# Altium schematic sheet Buttons.SchDoc
size B
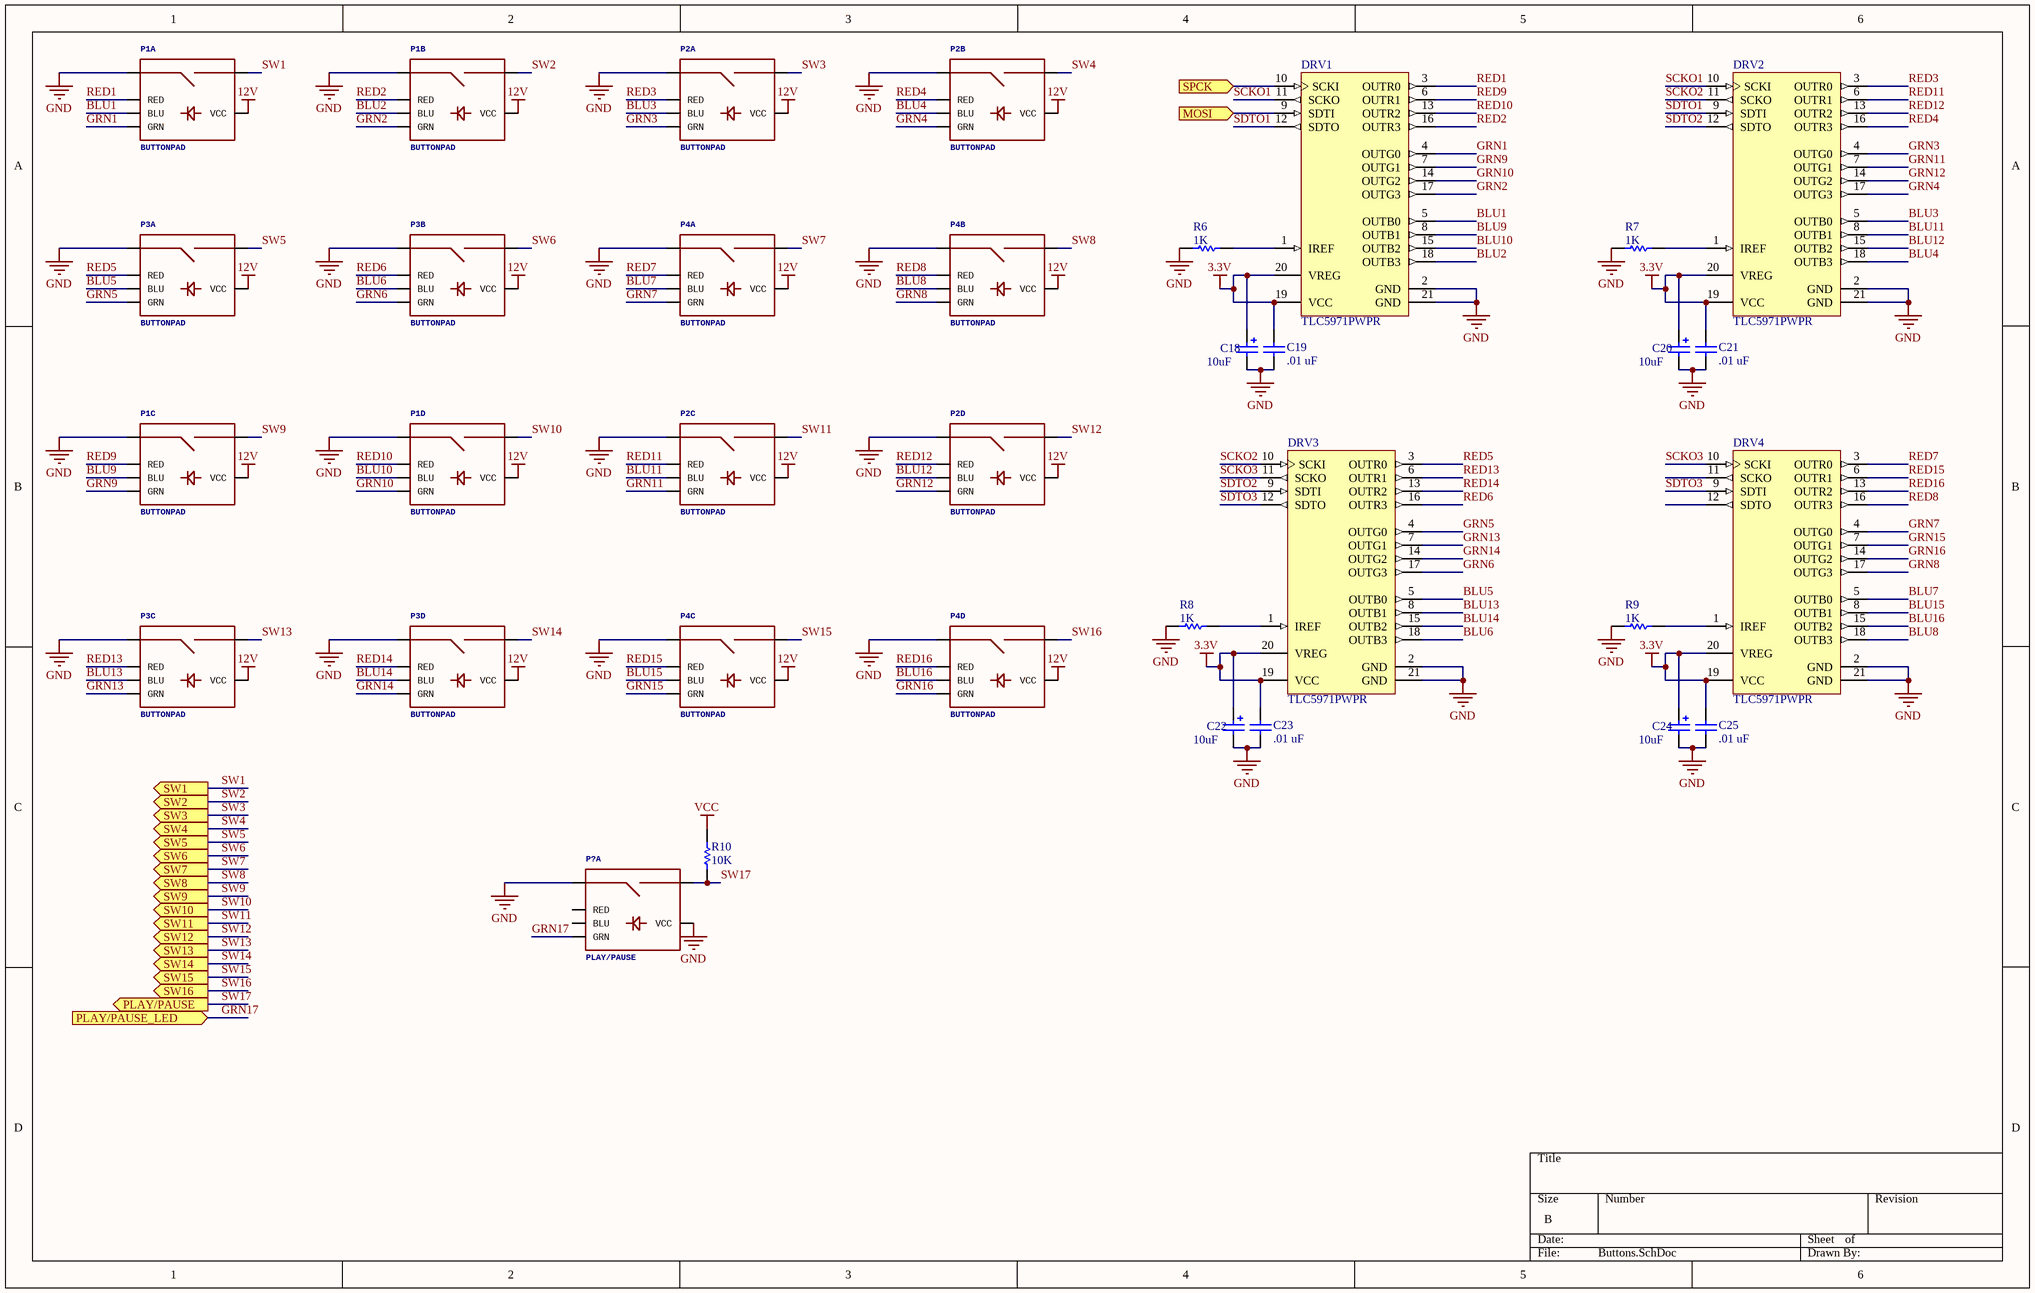
[diagram p0: Buttons.SchDoc]

## Parts
C18  value 10uF  [RAD-0.2]
C19  value .01 uF  [RAD-0.1]  (hidden comment: Cap)
C20  value 10uF  [RAD-0.2]
C21  value .01 uF  [RAD-0.1]  (hidden comment: Cap)
C22  value 10uF  [RAD-0.2]
C23  value .01 uF  [RAD-0.1]  (hidden comment: Cap)
C24  value 10uF  [RAD-0.2]
C25  value .01 uF  [RAD-0.1]  (hidden comment: Cap)
DRV1  TLC5971PWPR  [TI-PWP20-2965X2290TP_N]
DRV2  TLC5971PWPR  [TI-PWP20-2965X2290TP_N]
DRV3  TLC5971PWPR  [TI-PWP20-2965X2290TP_N]
DRV4  TLC5971PWPR  [TI-PWP20-2965X2290TP_N]
P1  BUTTONPAD  [BUTTONPAD-2X2]  (parts A,B,C,D of 4)
P2  BUTTONPAD  [BUTTONPAD-2X2]  (parts A,B,C,D of 4)
P3  BUTTONPAD  [BUTTONPAD-2X2]  (parts A,B,C,D of 4)
P4  BUTTONPAD  [BUTTONPAD-2X2]  (parts A,B,C,D of 4)
P?  PLAY/PAUSE  [BUTTONPAD-1X1]  (part A of 4)
R6  value 1K  [AXIAL-0.3]  (hidden comment: R1)
R7  value 1K  [AXIAL-0.3]  (hidden comment: R2)
R8  value 1K  [AXIAL-0.3]  (hidden comment: R3)
R9  value 1K  [AXIAL-0.3]  (hidden comment: R4)
R10  value 10K  [AXIAL-0.3]  (hidden comment: R3)

## Ports
MOSI (in), PLAY/PAUSE (out), PLAY/PAUSE_LED (in), SPCK (in), SW1 (out), SW2 (out), SW3 (out), SW4 (out), SW5 (out), SW6 (out), SW7 (out), SW8 (out), SW9 (out), SW10 (out), SW11 (out), SW12 (out), SW13 (out), SW14 (out), SW15 (out), SW16 (out)

## Nets
3.3V: C18.1 C19.2 C20.1 C21.2 C22.1 C23.2 C24.1 C25.2 DRV1.19(VCC) DRV1.20(VREG) DRV2.19(VCC) DRV2.20(VREG) DRV3.19(VCC) DRV3.20(VREG) DRV4.19(VCC) DRV4.20(VREG)
12V: P1.VCC1(VCC) P1.VCC2(VCC) P1.VCC3(VCC) P1.VCC4(VCC) P2.VCC1(VCC) P2.VCC2(VCC) P2.VCC3(VCC) P2.VCC4(VCC) P3.VCC1(VCC) P3.VCC2(VCC) P3.VCC3(VCC) P3.VCC4(VCC) P4.VCC1(VCC) P4.VCC2(VCC) P4.VCC3(VCC) P4.VCC4(VCC)
GND: C18.2 C19.1 C20.2 C21.1 C22.2 C23.1 C24.2 C25.1 DRV1.2(GND) DRV1.21(GND) DRV2.2(GND) DRV2.21(GND) DRV3.2(GND) DRV3.21(GND) DRV4.2(GND) DRV4.21(GND) P1.SIG1 P1.SIG3(SIG1) P1.SIG5(SIG1) P1.SIG7(SIG1) P2.SIG1 P2.SIG3(SIG1) P2.SIG5(SIG1) P2.SIG7(SIG1) P3.SIG1 P3.SIG3(SIG1) P3.SIG5(SIG1) P3.SIG7(SIG1) P4.SIG1 P4.SIG3(SIG1) P4.SIG5(SIG1) P4.SIG7(SIG1) P?.SIG1 P?.VCC1(VCC) R6.1 R7.1 R8.1 R9.1
VCC: R10.2
BLU1: DRV1.5(OUTB0) P1.BLU1(BLU)
BLU2: DRV1.18(OUTB3) P1.BLU2(BLU)
BLU3: DRV2.5(OUTB0) P2.BLU1(BLU)
BLU4: DRV2.18(OUTB3) P2.BLU2(BLU)
BLU5: DRV3.5(OUTB0) P3.BLU1(BLU)
BLU6: DRV3.18(OUTB3) P3.BLU2(BLU)
BLU7: DRV4.5(OUTB0) P4.BLU1(BLU)
BLU8: DRV4.18(OUTB3) P4.BLU2(BLU)
BLU9: DRV1.8(OUTB1) P1.BLU3(BLU)
BLU10: DRV1.15(OUTB2) P1.BLU4(BLU)
BLU11: DRV2.8(OUTB1) P2.BLU3(BLU)
BLU12: DRV2.15(OUTB2) P2.BLU4(BLU)
BLU13: DRV3.8(OUTB1) P3.BLU3(BLU)
BLU14: DRV3.15(OUTB2) P3.BLU4(BLU)
BLU15: DRV4.8(OUTB1) P4.BLU3(BLU)
BLU16: DRV4.15(OUTB2) P4.BLU4(BLU)
GRN1: DRV1.4(OUTG0) P1.GRN1(GRN)
GRN2: DRV1.17(OUTG3) P1.GRN2(GRN)
GRN3: DRV2.4(OUTG0) P2.GRN1(GRN)
GRN4: DRV2.17(OUTG3) P2.GRN2(GRN)
GRN5: DRV3.4(OUTG0) P3.GRN1(GRN)
GRN6: DRV3.17(OUTG3) P3.GRN2(GRN)
GRN7: DRV4.4(OUTG0) P4.GRN1(GRN)
GRN8: DRV4.17(OUTG3) P4.GRN2(GRN)
GRN9: DRV1.7(OUTG1) P1.GRN3(GRN)
GRN10: DRV1.14(OUTG2) P1.GRN4(GRN)
GRN11: DRV2.7(OUTG1) P2.GRN3(GRN)
GRN12: DRV2.14(OUTG2) P2.GRN4(GRN)
GRN13: DRV3.7(OUTG1) P3.GRN3(GRN)
GRN14: DRV3.14(OUTG2) P3.GRN4(GRN)
GRN15: DRV4.7(OUTG1) P4.GRN3(GRN)
GRN16: DRV4.14(OUTG2) P4.GRN4(GRN)
GRN17: P?.GRN1(GRN) ; port PLAY/PAUSE_LED
MOSI: DRV1.9(SDTI) ; port MOSI
RED1: DRV1.3(OUTR0) P1.RED1(RED)
RED2: DRV1.16(OUTR3) P1.RED2(RED)
RED3: DRV2.3(OUTR0) P2.RED1(RED)
RED4: DRV2.16(OUTR3) P2.RED2(RED)
RED5: DRV3.3(OUTR0) P3.RED1(RED)
RED6: DRV3.16(OUTR3) P3.RED2(RED)
RED7: DRV4.3(OUTR0) P4.RED1(RED)
RED8: DRV4.16(OUTR3) P4.RED2(RED)
RED9: DRV1.6(OUTR1) P1.RED3(RED)
RED10: DRV1.13(OUTR2) P1.RED4(RED)
RED11: DRV2.6(OUTR1) P2.RED3(RED)
RED12: DRV2.13(OUTR2) P2.RED4(RED)
RED13: DRV3.6(OUTR1) P3.RED3(RED)
RED14: DRV3.13(OUTR2) P3.RED4(RED)
RED15: DRV4.6(OUTR1) P4.RED3(RED)
RED16: DRV4.13(OUTR2) P4.RED4(RED)
SCKO1: DRV1.11(SCKO) DRV2.10(SCKI)
SCKO2: DRV2.11(SCKO) DRV3.10(SCKI)
SCKO3: DRV3.11(SCKO) DRV4.10(SCKI)
SDTO1: DRV1.12(SDTO) DRV2.9(SDTI)
SDTO2: DRV2.12(SDTO) DRV3.9(SDTI)
SDTO3: DRV3.12(SDTO) DRV4.9(SDTI)
SPCK: DRV1.10(SCKI) ; port SPCK
SW1: P1.SIG2 ; port SW1
SW2: P1.SIG4(SIG2) ; port SW2
SW3: P2.SIG2 ; port SW3
SW4: P2.SIG4(SIG2) ; port SW4
SW5: P3.SIG2 ; port SW5
SW6: P3.SIG4(SIG2) ; port SW6
SW7: P4.SIG2 ; port SW7
SW8: P4.SIG4(SIG2) ; port SW8
SW9: P1.SIG6(SIG2) ; port SW9
SW10: P1.SIG8(SIG2) ; port SW10
SW11: P2.SIG6(SIG2) ; port SW11
SW12: P2.SIG8(SIG2) ; port SW12
SW13: P3.SIG6(SIG2) ; port SW13
SW14: P3.SIG8(SIG2) ; port SW14
SW15: P4.SIG6(SIG2) ; port SW15
SW16: P4.SIG8(SIG2) ; port SW16
SW17: P?.SIG2 R10.1 ; port PLAY/PAUSE
NetDRV1_1: DRV1.1(IREF) R6.2
NetDRV2_1: DRV2.1(IREF) R7.2
NetDRV3_1: DRV3.1(IREF) R8.2
NetDRV4_1: DRV4.1(IREF) R9.2

Not connected (* = marked no-connect by the designer): DRV4 11(SCKO) 12(SDTO); P? BLU1(BLU) RED1(RED)

## Library data of the parts
C18 C20 C22 C24 = Cap Pol2: Polarized Capacitor (Axial); Published: 8-Jun-2000; LatestRevisionDate: 17-Jul-2002; LatestRevisionNote: Re-released for DXP Platform.; PackageReference: POLAR0.8; Publisher: Altium Limited; PackageDescription: Polarized Capacitor; 2 Leads
C19 C21 C23 C25 = Cap: Capacitor; Published: 8-Jun-2000; LatestRevisionDate: 17-Jul-2002; LatestRevisionNote: Re-released for DXP Platform.; PackageReference: RAD-0.3; Publisher: Altium Limited; PackageDescription: Radial Cap, Thru-Hole; 2 Leads; 0.3 in Pin Spacing
DRV1-DRV4 = TLC5971PWPR: 12-Channel, 16-Bit ES-PWM RGB LED Driver with 3.3 V Linear Regulator, 6 to 17 V, -40 to 85 degC, 20-pin SOP (PWP20), Green (RoHS & no Sb/Br); Manufacturer: Texas Instruments; Rating: Catalog; Vin(Max)(V): 17; Vin(Min)(V): 6; DatasheetVersion: SBVS146C; PackageVersion: 4073225-4/I; PackageReference: PWP20-2965X2290TP; PackageDescription: 20-Lead, Plastic Small Outline, Body Size 4.4 x 6.5 mm, Pitch 0.65 mm; Supplier 1: Digi-Key; Supplier Part Number 1: 296-27796-2-ND; Supplier 2: Digi-Key; Supplier Part Number 2: 296-27796-1-ND; Supplier 3: Digi-Key; Supplier Part Number 3: 296-27796-6-ND; Supplier 4: Newark; Supplier Part Number 4: 01T0730; Supplier 5: Mouser; Supplier Part Number 5: 595-TLC5971PWPR; Eco-Plan: Green (RoHS & no Sb/Br); SubFamily: LED Driver; Mounting Technology: Surface Mount; Code_JEDEC: MO-153; PartNumber: TLC5971PWPR; ComponentLink1Description: Manufacturer URL; ComponentLink1URL: http://www.ti.com/; ComponentLink2Description: Datasheet; ComponentLink2URL: http://www.ti.com/general/docs/lit/getliterature.tsp?genericPartNumber=TLC5971&fileType=pdf; ComponentLink3Description: Package Specification; ComponentLink3URL: http://www.ti.com/litv/pdf/mhts001g
P1-P4 P? = BUTTONPAD-2X2: 5mm Button PadProven layout and schematic for 2x2 button pad. Panelize this device/fp to a 4x4 pad if needed. Spark Fun Electronics SKU : COM-07835. Compatible common cathode tri-color LED SKU : COM-00105
R6-R10 = Res1: Resistor; Published: 8-Jun-2000; LatestRevisionDate: 17-Jul-2002; LatestRevisionNote: Re-released for DXP Platform.; PackageReference: AXIAL-0.3; Publisher: Altium Limited; PackageDescription: Axial Device, Thru-Hole; 2 Leads; 0.3 in Pin Spacing